# Altium schematic sheet Esq.SchDoc
size A3; SheetNumber: 1; SheetTotal: 1
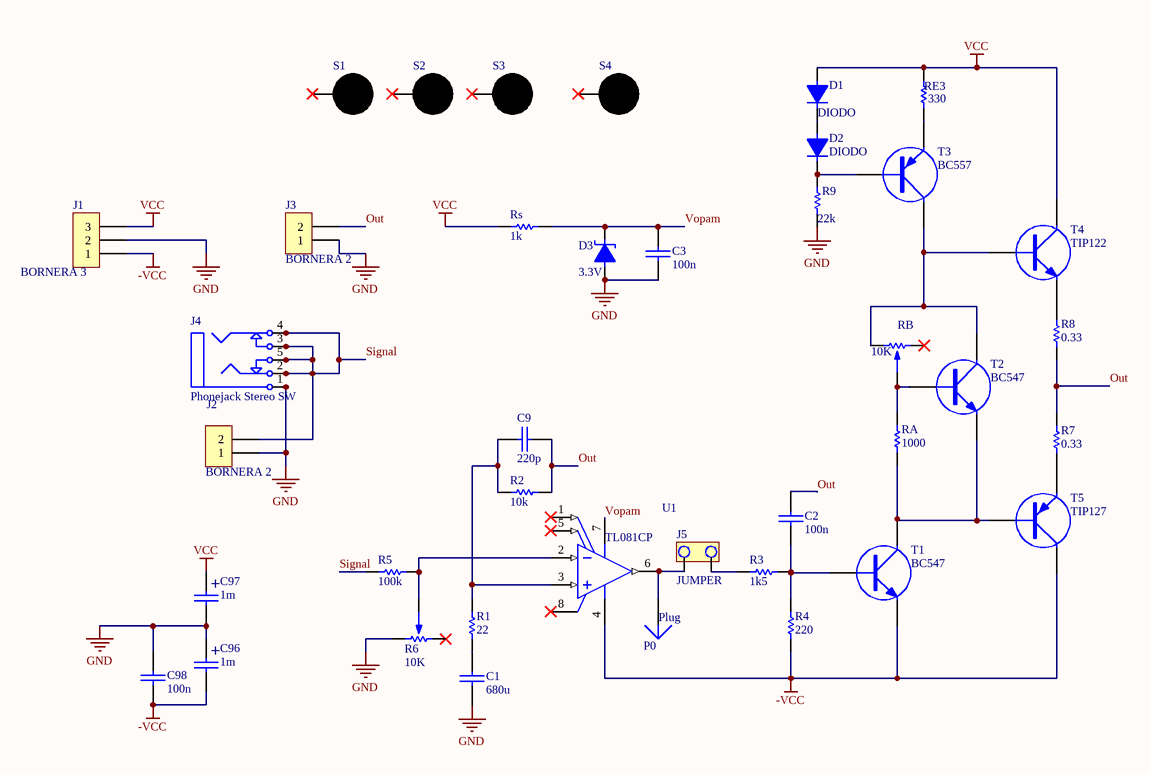
[diagram p0: Esq.SchDoc]

## Parts
C1  680u  [CAP200]
C2  100n  [CAP200]
C3  100n  [CAP200]
C9  220p  [CAP200]
C96  1m  [CAP200RP2]
C97  1m  [CAP200RP2]
C98  100n  [CAP200]
D1  DIODO  [DO41]
D2  DIODO  [DO41]
D3  3.3V  [DO41]
J1  BORNERA 3  [BORNERA3]
J2  BORNERA 2  [BORNERA2]
J3  BORNERA 2  [BORNERA2]
J4  Phonejack Stereo SW  [ST-3150-5N]
J5  JUMPER  [JUMPER2]
P0  Plug  [PIN1]
R1  22  [RES400]
R2  10k  [RES400]
R3  1k5  [RES400]
R4  220  [RES400]
R5  100k  [RES400]
R6  10K  [PRESET V]
R7  0.33  [RES600]
R8  0.33  [RES600]
R9  22k  [RES400]
RA  1000  [RES400]
RB  10K  [PRESET V]
RE3  330  [RES400]
Rs  1k  [RES600]
S1  (no value)  [SUJECION (5.00MM - 3.50MM)]
S2  (no value)  [SUJECION (5.00MM - 3.50MM)]
S3  (no value)  [SUJECION (5.00MM - 3.50MM)]
S4  (no value)  [SUJECION (5.00MM - 3.50MM)]
T1  BC547  [TO92]
T2  BC547  [TO92]
T3  BC557  [TO92]
T4  TIP122  [TO-220 V]
T5  TIP127  [TO-220 V]
U1  TL081CP  [P0008A]

## Nets
-VCC: C96.2 C98.1 J1.1 R4.1 T1.3(E) T5.2(C) U1.4(VCC-)
GND: C1.2 C3.1 C96.1 C97.2 C98.2 D3.1 J1.2 J2.1 J3.1 J4.1 J4.1A J4.1B R6.1 R9.1
VCC: C97.1 D1.1 J1.3 RE3.2 Rs.1 T4.2(C)
Out: C2.1 C9.2 J3.2 R2.2 R7.2 R8.1
Signal: J2.2 J4.2 J4.2A J4.2B J4.3 J4.3A J4.3B J4.4 J4.4A J4.4B J4.5 J4.5A J4.5B R5.2
Vopam: C3.2 D3.2 Rs.2 U1.7(VCC+)
NetC1_1: C1.1 R1.1
NetC2_2: C2.2 R3.2 R4.2 T1.1(B)
NetC9_1: C9.1 R1.2 R2.1 U1.3(IN+)
NetD1_2: D1.2 D2.1
NetD2_2: D2.2 R9.2 T3.1(B)
NetJ5_1: J5.1 R3.1
NetJ5_2: J5.2 P0.1 U1.6(OUT)
NetR5_1: R5.1 R6.2 U1.2(IN-)
NetR7_1: R7.1 T5.3(E)
NetR8_2: R8.2 T4.3(E)
NetRA_1: RA.1 T1.2(C) T2.3(E) T5.1(B)
NetRA_2: RA.2 RB.2 T2.1(B)
NetRB_3: RB.3 T2.2(C) T3.2(C) T4.1(B)
NetRE3_1: RE3.1 T3.3(E)

Not connected (* = marked no-connect by the designer): R6 3*; RB 1*; S1 1*; S2 1*; S3 1*; S4 1*; U1 1(OFFSET_N1)* 5(OFFSET_N2)* 8(NC)*

## Notes on the sheet
- (in symbol CAPPOL) +

## Library data of the parts
C1-C3 C9 C98 = CAP
C96 C97 = CAPPOL
D3 = DIODO ZENER
J4 = Phonejack Stereo SW: 3-Conductor Jack with 2 break contacts (normals) and 2 auxiliary make contacts; Published: 5-Jan-2004; LatestRevisionDate: 17-Dec-2003; LatestRevisionNote: PCB Footprint replaced.; DatasheetDocument: 07-Mar-2000; Publisher: Altium Limited; ComponentLink1Description: Manufacturer Link; ComponentLink1URL: http://domino.kycon.com/internet/Products.html
R1-R5 R7-R9 RA RE3 Rs = RES
R6 RB = PRESET
S1-S4 = SUJECION
T1 T2 T4 = TRANSISTOR NPN
T3 T5 = TRANSISTOR PNP
U1 = CMP-0017-00937-2: JFET-Input Operational Amplifier, 7 to 36 V, 0 to 70 degC, 8-pin DIP (P8), Pb-Free (RoHS); Manufacturer: Texas Instruments; Rating: Military; GBW(Typ)(MHz): 3; Vio (25C)(Max)(mV): 15; CMRR(Min)(dB): 70; Slew Rate(Typ)(V/us): 13; IIB(Max)(pA): 400; Vn at 1kHz(Typ)(nV/rtHz): 18; Sub Family: General Purpose Amplifier, High Supply Voltage Amplifier (>=30V); Number of Channels: 1; Total Supply Voltage(Min)(+5V is 5, +/-5V is 10): 7; Total Supply Voltage(Max)(+5V is 5, +/-5V is 10): 36; Iq per channel(Max)(mA): 2.8; Eco-Plan: Pb-Free (RoHS); PackageReference: P0008A; ComponentLink3URL: http://www.ti.com/litv/pdf/mpdi001b; ComponentLink1URL: http://www.ti.com/; Mounting Technology: Through Hole; Code_JEDEC: MS-001; ComponentLink3Description: Package Specification; PartNumber: TL081CP; PackageVersion: 4040082/E, 04/2010; ComponentLink2Description: Datasheet; DatasheetVersion: SLOS081G; PackageDescription: 8-Pin Plastic In-Line, Body 9.59 x 6.35 mm, Pitch 2.54 mm; ComponentLink2URL: http://www.ti.com/lit/ds/symlink/tl081.pdf; Offset Drift(Typ)(uV/C): 18; ComponentLink1Description: Manufacturer URL
P0 = Plug: LatestRevisionDate: 17-Jul-2002; LatestRevisionNote: Re-released for DXP Platform.; Publisher: Altium Limited